# EAGLE design pie-shield (EAGLE 6.4)
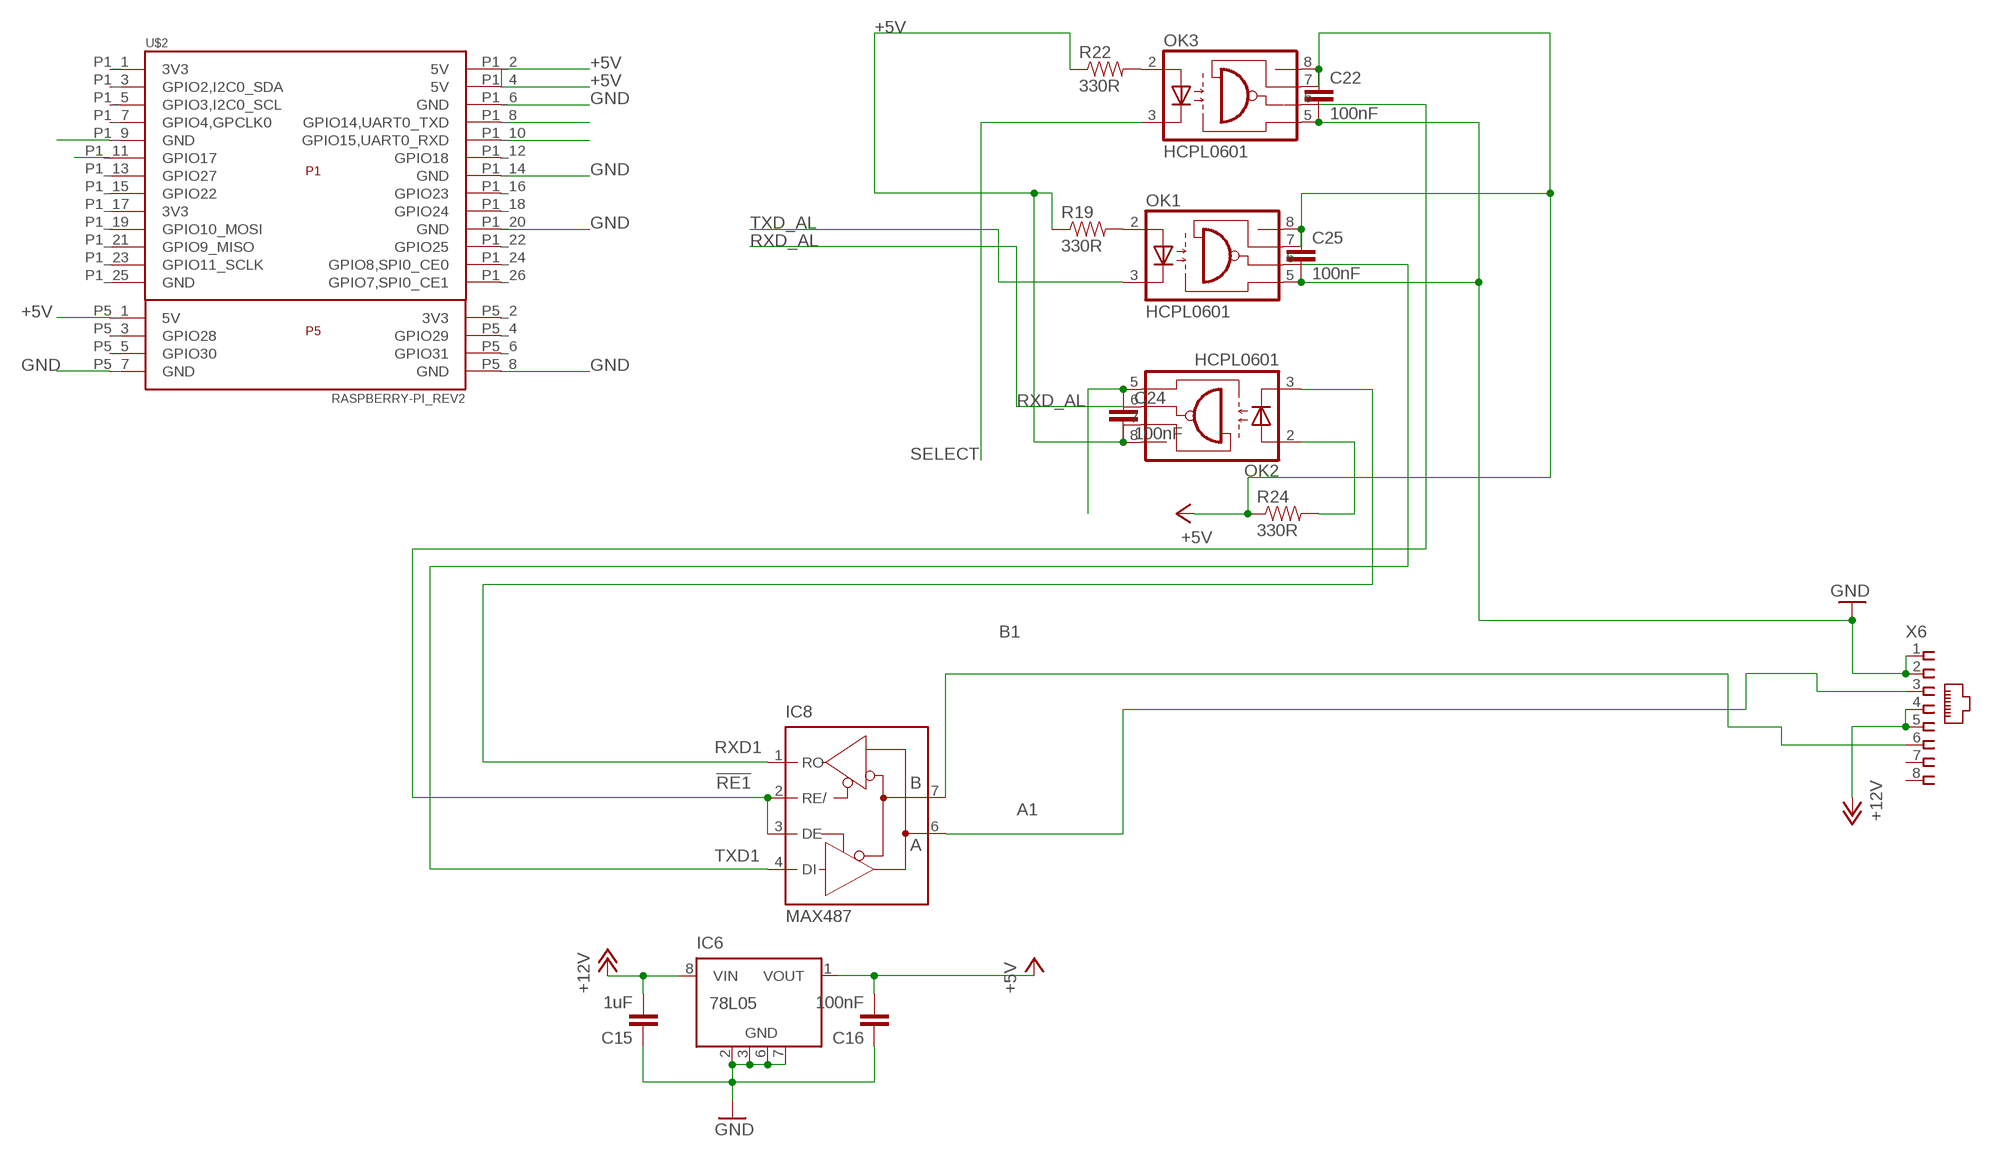
[diagram p0: schematic, sheet 1]

## Parts
C15  1uF  CAP0805  [0805]
C16  100nF  CAP0805  [0805]
C22  100nF  CAP0805  [0805]
C24  100nF  CAP0805  [0805]
C25  100nF  CAP0805  [0805]
IC6  78L05  78L05SMD  [SO08]
IC8  MAX487  MAX481CSA  [SO08]
OK1  HCPL0601  [SOIC08]
OK2  HCPL0601  [SOIC08]
OK3  HCPL0601  [SOIC08]
R19  330R  RESISTOR0805-RES  [0805]
R22  330R  RESISTOR0805-RES  [0805]
R24  330R  RESISTOR0805-RES  [0805]
U$2  RASPBERRY-PI_REV2  [RASPBERRY-PI_REV2]
X6  RJ45-8L-B  [RJ45-NO-SHIELD]

## Nets
!RE1: IC8.2(RE/) IC8.3(DE) OK3.6(VO)
+5V: C24.2 OK2.7(VE) OK2.8(VCC) R19.1 R22.1 U$2.P1_2(5V) U$2.P1_4(5V) U$2.P5_1(5V)
+5V1: C16.2 C22.1 C25.1 IC6.1(VOUT) OK1.7(VE) OK1.8(VCC) OK3.7(VE) OK3.8(VCC) R24.1 ; supply symbol labelled +5V
+24V: C15.2 IC6.8(VIN) X6.4 X6.5 ; supply symbol labelled +12V
A1: IC8.6(A) X6.3
B1: IC8.7(B) X6.6
GND: C24.1 OK2.5(GND) U$2.P1_6(GND) U$2.P1_9(GND) U$2.P1_14(GND) U$2.P1_20(GND) U$2.P5_7(GND) U$2.P5_8(GND)
GND_AL: C15.1 C16.1 C22.2 C25.2 IC6.2(GND) IC6.3(GND) IC6.6(GND) IC6.7(GND) OK1.5(GND) OK3.5(GND) X6.1 X6.2 ; supply symbol labelled GND
N$32: OK1.2(A) R19.2
N$37: OK2.2(A) R24.2
N$44: OK3.2(A) R22.2
RXD1: IC8.1(RO) OK2.3(C)
RXD_AL: OK2.6(VO) U$2.P1_10(GPIO15,UART0_RXD)
SELECT: OK3.3(C) U$2.P1_11(GPIO17)
TXD1: IC8.4(DI) OK1.6(VO)
TXD_AL: OK1.3(C) U$2.P1_8(GPIO14,UART0_TXD)
Unconnected: IC6.4(NC) IC6.5(NC) U$2.P1_1(3V3) U$2.P1_3(GPIO2,I2C0_SDA) U$2.P1_5(GPIO3,I2C0_SCL) U$2.P1_7(GPIO4,GPCLK0) U$2.P1_12(GPIO18) U$2.P1_13(GPIO27) U$2.P1_15(GPIO22) U$2.P1_16(GPIO23) U$2.P1_17(3V3) U$2.P1_18(GPIO24) U$2.P1_19(GPIO10_MOSI) U$2.P1_21(GPIO9_MISO) U$2.P1_22(GPIO25) U$2.P1_23(GPIO11_SCLK) U$2.P1_24(GPIO8,SPI0_CE0) U$2.P1_25(GND) U$2.P1_26(GPIO7,SPI0_CE1) U$2.P5_2(3V3) U$2.P5_3(GPIO28) U$2.P5_4(GPIO29) U$2.P5_5(GPIO30) U$2.P5_6(GPIO31) X6.7 X6.8

## Power pins joined to a net without a drawn wire
GND_AL: IC8.5(GND)
VCC: IC8.8(VCC)

## Library data of the parts
C15 C16 C22 C24 C25 = SparkFun:CAP: Capacitor Standard 0603 ceramic capacitor, and 0.1" leaded capacitor.
IC6 = linear:78L*SMD: Positive VOLTAGE REGULATOR
IC8 = maxim:MAX481CSA: RS485 TRANSEIVER; MF: MAXIM; MPN: MAX481CSA; OC_FARNELL: unknown; OC_NEWARK: 90C3817
OK1-OK3 = optocoupler:HCPL0601: HEWLETT PACKARD OPTO COUPLER; MF: AGILENT TECHNOLOGIES; MPN: HCPL-0601-000E; OC_FARNELL: 9995102; OC_NEWARK: 88H7776
R19 R22 R24 = SparkFun:RESISTOR: Resistor Basic schematic elements and footprints for 0603, 1206, and PTH resistors.
U$2 = RaspberryPi:RASPBERRY-PI_REV2: Raspberry Pi Board <http://www.raspberrypi.org/> Jacques Lagnel V1.0 (beta) 2012 Mateusz Bawaj V1.1 (beta) 2012 Board dimension: Forum 3D model <http://www.raspberrypi.org/forum/general-discussion/mechanical-profile-3d-models?value=3d%20model&type=1&include=1&search=1&ret=all> The GPIO Connector (P1): http://elinux.org/RPi_Low-level_peripherals The GPIO Connector (P5): http://www.raspberrypi-spy.co.uk/2012/09/raspberry-pi-p5-header/
X6 = con-tycoelectronics:RJ45: CORCOM Modular RJ Jacks No Shield Source: www.tycoelectronics.com .. ENG_DS_1654001_1099_RJ_L_0507.pdf; MF: TYCO ELECTRONICS; MPN: RJ45-8L-B; OC_FARNELL: 1279843; OC_NEWARK: 52K4445

## Board
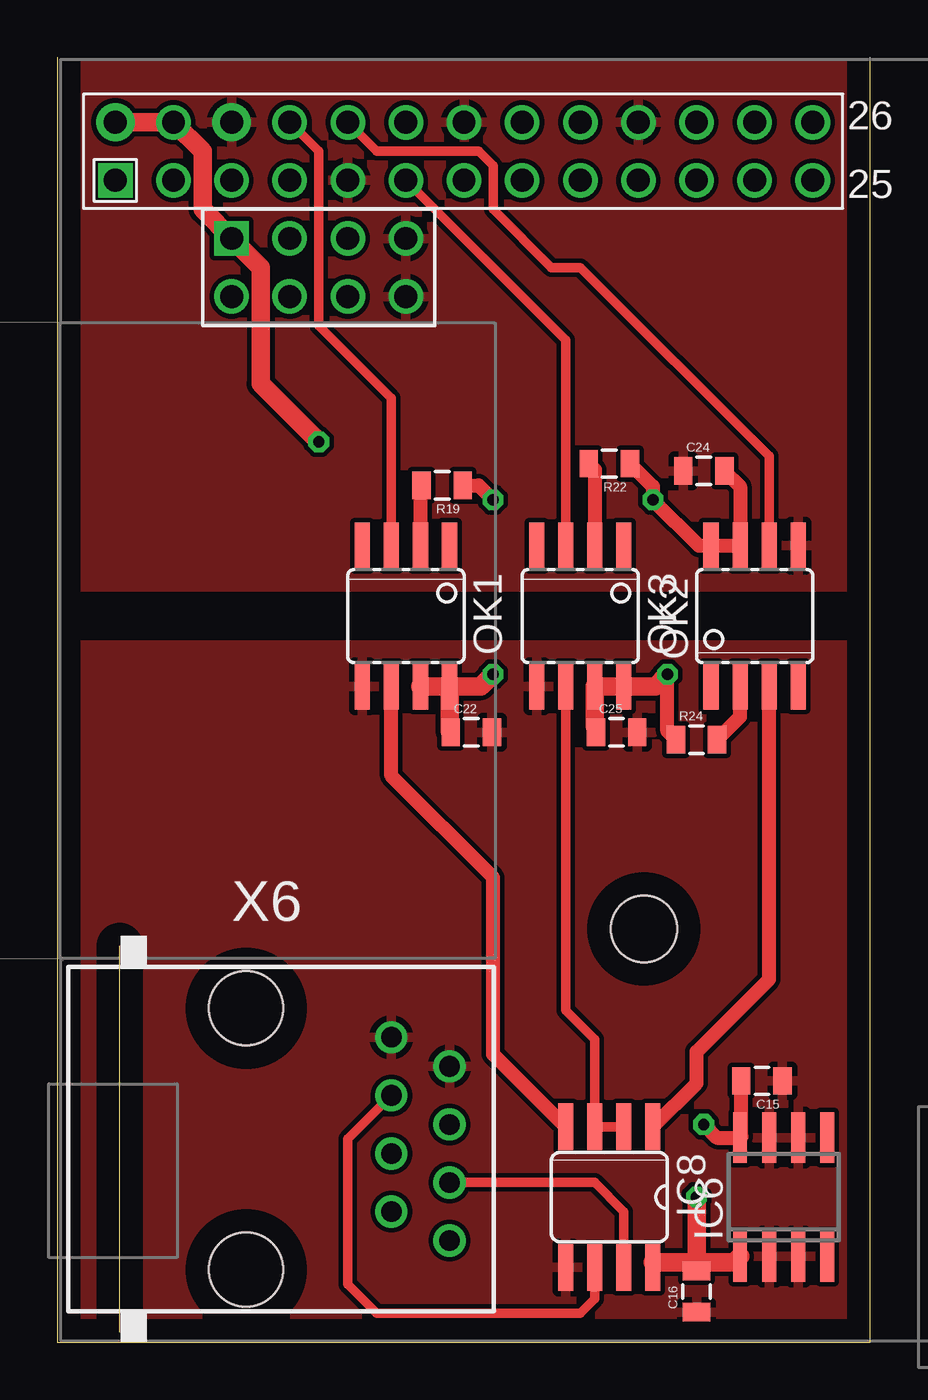
[diagram p1: board, top side]
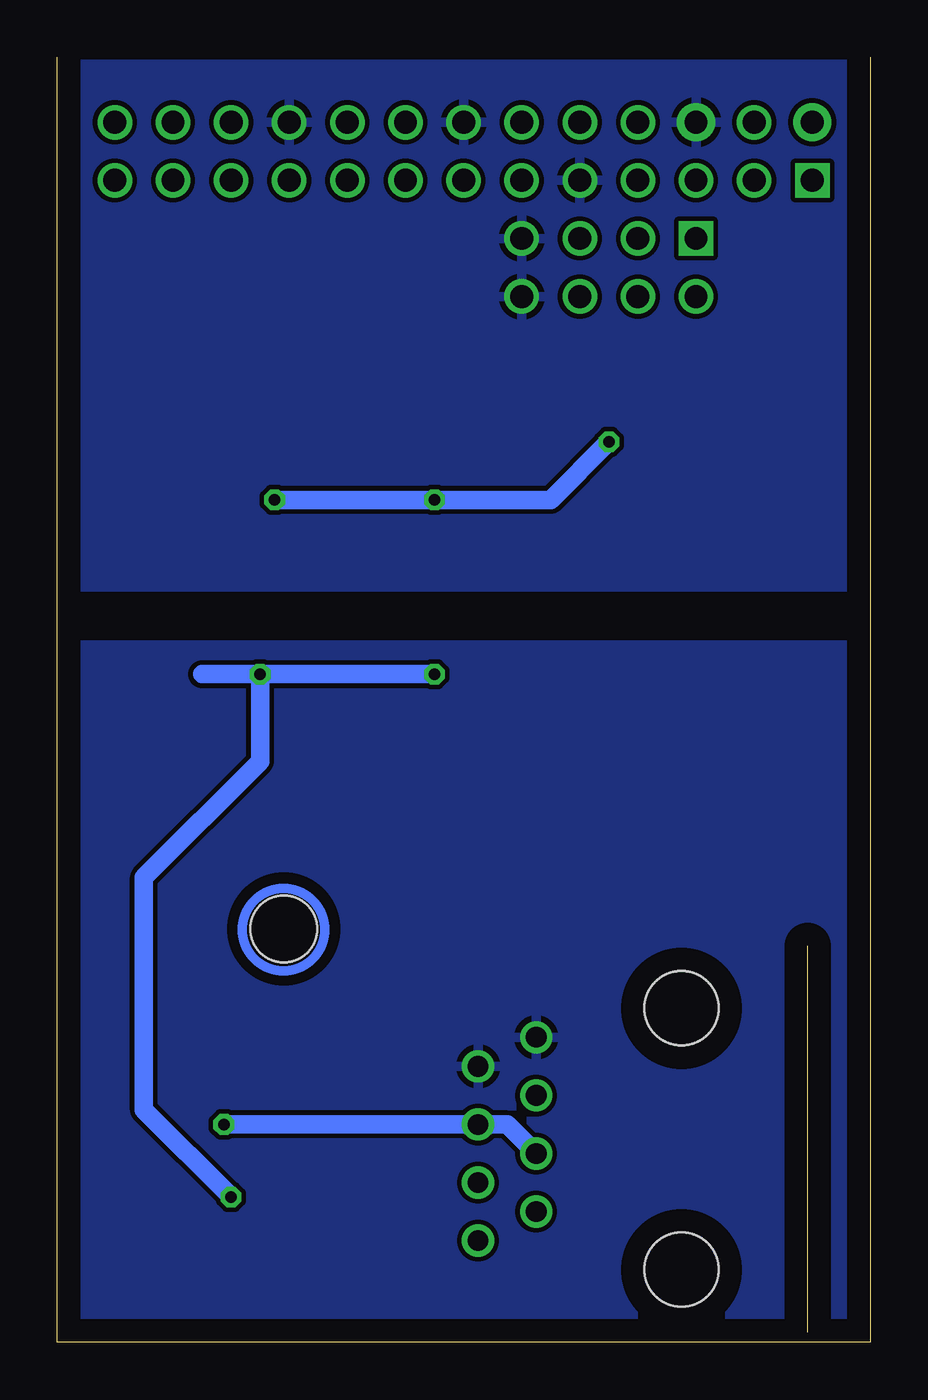
[diagram p2: board, bottom side, seen from below]

Size 35.54 x 56.19 mm. Coordinates in mm from the lower left corner, seen from the top.
Outline: 35.54,56.19 35.54,0 0,0 0,56.19
Copper layers (1*16): Top 0.035mm / dielectric 1.5mm / Bottom 0.035mm
Design rules "default": minimum track width 10mil, minimum drill 24mil, track to track 8mil, track to pad 8mil, pad to pad 8mil, via to via 8mil, smd to smd 8mil, copper to edge 40mil, drill to drill 8mil, minimum pad ring 10mil, minimum via ring 8mil, stop-mask expansion 4mil, vias tented up to drill 0mil, thermal gap 10mil

### Footprints (pad centres in the part's own frame; a part is rotated, then mirrored left to right if it is on the bottom)
0805 = smd 0.8 x 1.2: 1 -0.9,0; 2 0.9,0
SO08 = smd 0.6 x 2.2: 1 -1.905,-2.6; 2 -0.635,-2.6; 3 0.635,-2.6; 4 1.905,-2.6; 5 1.905,2.6; 6 0.635,2.6; 7 -0.635,2.6; 8 -1.905,2.6
SO08' = smd 0.66 x 2.032: 1 -1.905,-3.073; 2 -0.635,-3.073; 3 0.635,-3.073; 4 1.905,-3.073; 5 1.905,3.073; 6 0.635,3.073; 7 -0.635,3.073; 8 -1.905,3.073
SOIC08 = smd 0.66 x 2.032: 1 -1.905,-3.073; 2 -0.635,-3.073; 3 0.635,-3.073; 4 1.905,-3.073; 5 1.905,3.073; 6 0.635,3.073; 7 -0.635,3.073; 8 -1.905,3.073
RASPBERRY-PI_REV2 = drill 1 square: P1_1 -41.91,21.59; P5_1 -36.83,19.05 | drill 1 pad 1.676: P1_2 -41.91,24.13; P1_6 -36.83,24.13 | drill 1: P1_3 -39.37,21.59; P1_4 -39.37,24.13; P1_5 -36.83,21.59; P1_7 -34.29,21.59; P1_8 -34.29,24.13; P1_9 -31.75,21.59; P1_10 -31.75,24.13; P1_11 -29.21,21.59; P1_12 -29.21,24.13; P1_13 -26.67,21.59; P1_14 -26.67,24.13; P1_15 -24.13,21.59; P1_16 -24.13,24.13; P1_17 -21.59,21.59; P1_18 -21.59,24.13; P1_19 -19.05,21.59; P1_20 -19.05,24.13; P1_21 -16.51,21.59; P1_22 -16.51,24.13; P1_23 -13.97,21.59; P1_24 -13.97,24.13; P1_25 -11.43,21.59; P1_26 -11.43,24.13; P5_2 -36.83,16.51; P5_3 -34.29,19.05; P5_4 -34.29,16.51; P5_5 -31.75,19.05; P5_6 -31.75,16.51; P5_7 -29.21,19.05; P5_8 -29.21,16.51 | hole 2.9: -18.81,-11.135
RJ45-NO-SHIELD = drill 0.9 pad 1.4: 1 -4.445,6.35; 2 -3.175,8.89; 3 -1.905,6.35; 4 -0.635,8.89; 5 0.635,6.35; 6 1.905,8.89; 7 3.175,6.35; 8 4.445,8.89 | hole 3.251: -5.715,0; 5.715,0

### Placement (x,y rotation side)
C15  30.8,11.43 180 top
C16  27.94,2.22 90 top
C22  18.1,26.67 0 top
C24  28.26,38.1 0 top
C25  24.45,26.67 0 top
IC6  31.75,6.35 0 top
IC8  MAX487  [SO08']  24.13,6.35 180 top
OK1  15.24,31.75 180 top
OK2  30.48,31.75 0 top
OK3  22.86,31.75 180 top
R19  16.83,37.47 180 top
R22  24.13,38.42 180 top
R24  27.94,26.35 0 top
U$2  44.45,29.21 0 top
X6  8.26,8.89 270 top

### Tracks (layer width: path | path; a pad name or v marks a point on that pad's centre or on a via)
!RE1
  Top 0.406: OK3.6 22.23,14.5 23.5,13.23 IC8.3 IC8.2
+5V  (via drill 0.5)
  Top 0.61: R22.1 26.04,37.41 v26.04,36.83 28.04,34.82 OK2.8 OK2.7 29.84,37.41 C24.2 | R19.1 18.41,37.47 v19.05,36.83
  Top 0.813: U$2.P1_2 U$2.P1_4 6.35,52.07 6.35,49.53 U$2.P5_1 8.89,46.99 8.89,41.91 v11.43,39.37
  Bottom 0.813: v11.43,39.37 13.97,36.83 v19.05,36.83 v26.04,36.83
+5V1  (via drill 0.5)
  Top 0.406: C22.1 17.14,26.72 | C25.1 23.5,26.93
  Top 0.61: R24.1 26.67,26.72 v26.67,29.21
  Top 0.813: 17.14,26.72 OK1.8 | 23.5,26.93 OK3.7 OK3.8 26.14,28.68 v26.67,29.21 | OK1.7 OK1.8 | OK1.8 18.52,28.68 v19.05,29.21 | IC6.1 29.59,3.49 27.94,3.49 | 27.94,3.49 26.04,3.49 | C16.2 27.94,3.49 | 27.94,3.49 v27.94,6.35
  Bottom 0.813: 29.21,29.21 v26.67,29.21 | v26.67,29.21 v19.05,29.21 | v27.94,6.35 31.75,10.16 31.75,20.32 26.67,25.4 v26.67,29.21
+24V  (via drill 0.5)
  Top 0.406: IC6.8 29.9,9
  Top 0.61: v28.26,9.53 28.83,8.95 IC6.8 | 29.9,9 C15.2
  Bottom 0.813: X6.5 15.88,9.53 X6.4 v28.26,9.53
A1
  Top 0.406: X6.3 12.7,8.89 12.7,2.54 13.97,1.27 22.86,1.27 23.5,1.91 IC8.6
B1
  Top 0.406: X6.6 23.5,6.99 24.77,5.71 IC8.7
GND
  pour Bottom: -1.27,55.88 36.83,55.88 36.83,33.02 -1.27,33.02
  pour Top: -1.27,55.88 36.83,55.88 36.83,33.02 -1.27,33.02
GND_AL
  pour Bottom: 36.83,0 -1.27,0 -1.27,30.48 36.83,30.48
  pour Top: -1.27,30.48 36.83,30.48 36.83,0 -1.27,0
N$32
  Top 0.61: R19.2 15.88,37.41 OK1.2
N$37
  Top 0.61: R24.2 29.84,27.36 OK2.2
N$44
  Top 0.61: R22.2 23.5,38.15 OK3.2
RXD1
  Top 0.61: IC8.1 27.94,11.33 27.94,12.7 31.11,15.88 OK2.3
RXD_AL
  Top 0.406: OK2.6 31.11,38.73 22.86,46.99 21.59,46.99 19.05,49.53 19.05,51.44 18.41,52.07 13.97,52.07 U$2.P1_10
SELECT
  Top 0.406: OK3.3 22.23,35.56 22.23,36.2 22.23,43.81 U$2.P1_11
TXD1
  Top 0.61: IC8.4 19.05,12.6 19.05,20.32 14.61,24.77 OK1.6
TXD_AL
  Top 0.406: OK1.3 14.61,41.27 11.43,44.45 11.43,52.07 U$2.P1_8
(copper drawn outside any net)
  shapes: Bottom circle x1